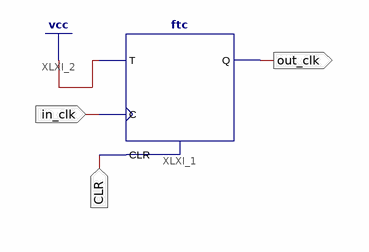
[diagram p0: schematic sheet 1]
// Xilinx ISE schematic DividerBy2.sch (spartan6) as structural Verilog: 1 symbols, 3 ports
module DividerBy2 (
  input  CLR,
  input  in_clk,
  output out_clk
);

  ftc XLXI_1 (.C(in_clk), .CLR(CLR), .T(1'b1), .Q(out_clk));
endmodule
